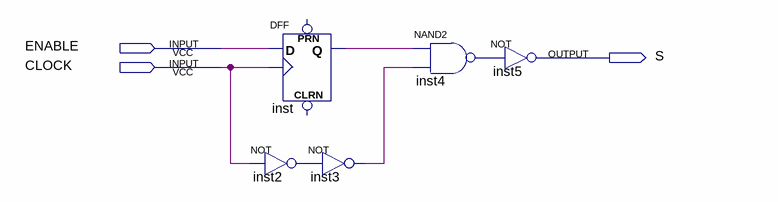
[diagram p0: schematic sheet]
// Quartus schematic PC_register_increment.bdf as structural Verilog: 5 symbols, 3 pins
module PC_register_increment (
  input  ENABLE,
  input  CLOCK,
  output S
);

  wire inst2_out, inst3_out, inst4_out, inst_q;

  DFF inst (.CLK(CLOCK), .D(ENABLE), .Q(inst_q));  // open: CLRN, PRN
  not inst2 (inst2_out, CLOCK);
  not inst3 (inst3_out, inst2_out);
  nand inst4 (inst4_out, inst_q, inst3_out);
  not inst5 (S, inst4_out);
endmodule
